# Altium schematic sheet dHandlebar_Lateral.SchDoc: dHandlebar_Lateral
size A4; Date: 05/09/2023; CheckedBy: Alejandro Veiga López; Author: Alejandro Veiga López; CompanyName: SICMA21; Engineer: Alejandro Veiga López; Organization: SICMA21; Address1: Carrer de la Ceràmica, 1; Address2: Montcada i Reixac, Barcelona; DocumentNumber: rfwe; Revision: rew; SheetNumber: 1; SheetTotal: 1; Project: PCB_dHandlebar_Lateral; Time: re; ProjectName: Smart Rollator
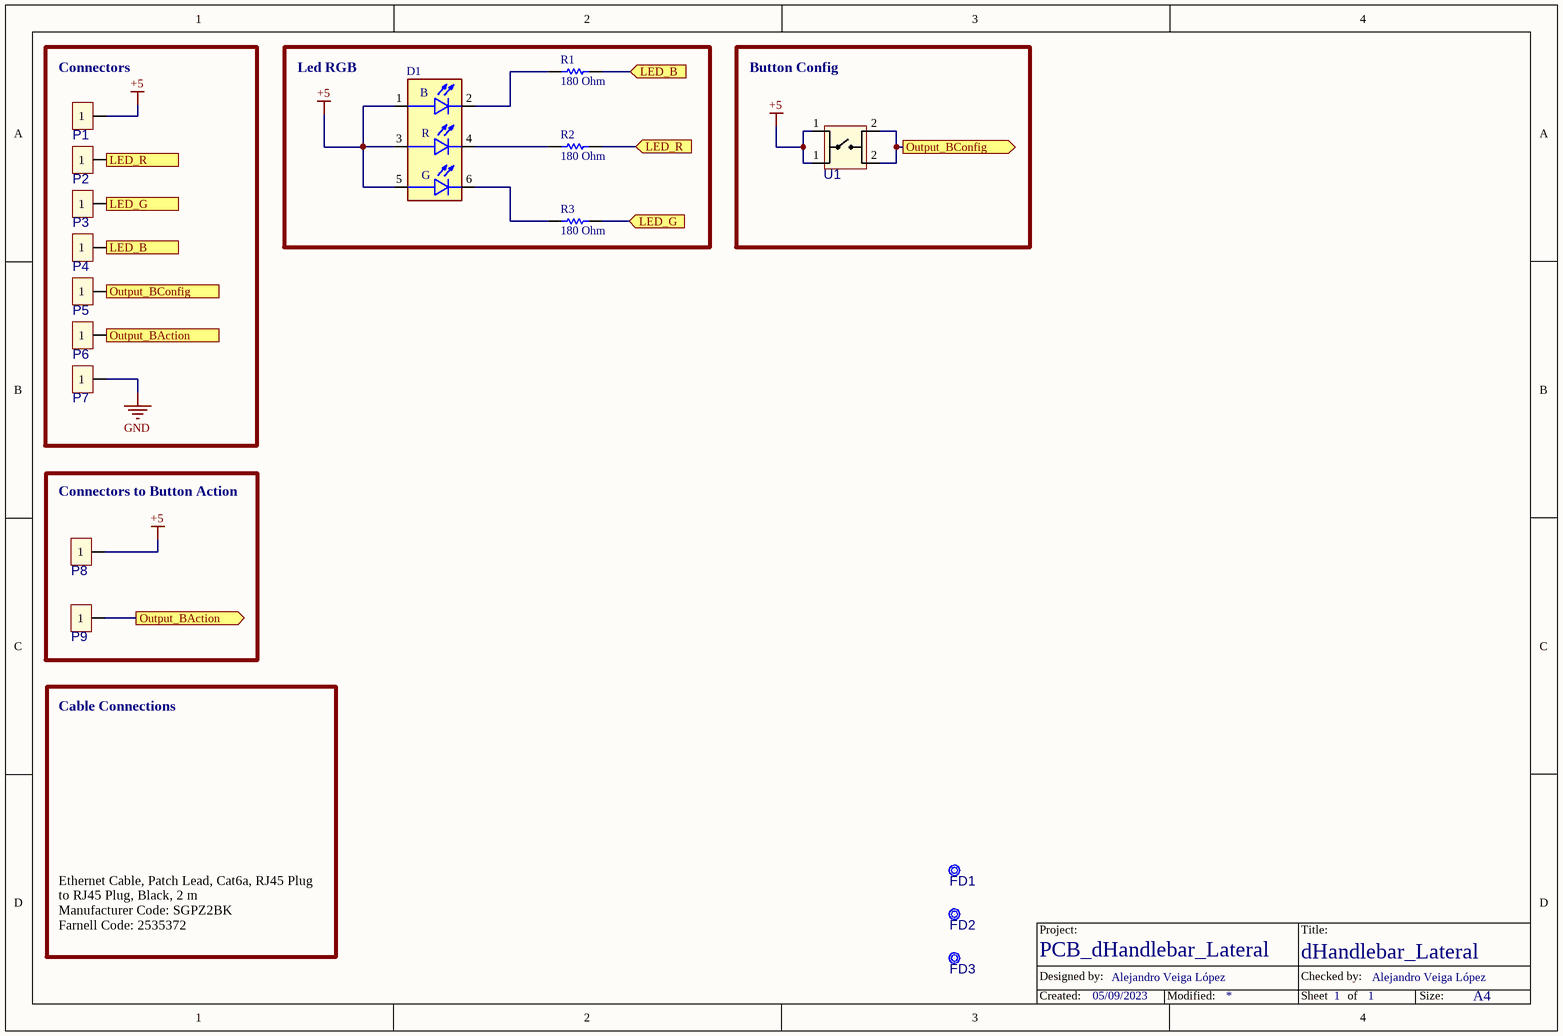
[diagram p0: dHandlebar_Lateral.SchDoc]

## Parts
D1  LED RGB  [LED RGB SMD - QLS6B-FKW-CNSNSF043]  (value not drawn)
FD1  FIDUCIAL ROUND  [Fiducial 1mm]  (value not drawn)
FD2  FIDUCIAL ROUND  [Fiducial 1mm]  (value not drawn)
FD3  FIDUCIAL ROUND  [Fiducial 1mm]  (value not drawn)
P1  JUMPER x2  [Connector - 1 Pad 1x2mm]  (value not drawn)
P2  JUMPER x2  [Connector - 1 Pad 1x2mm]  (value not drawn)
P3  JUMPER x2  [Connector - 1 Pad 1x2mm]  (value not drawn)
P4  JUMPER x2  [Connector - 1 Pad 1x2mm]  (value not drawn)
P5  JUMPER x2  [Connector - 1 Pad 1x2mm]  (value not drawn)
P6  JUMPER x2  [Connector - 1 Pad 1x2mm]  (value not drawn)
P7  JUMPER x2  [Connector - 1 Pad 1x2mm]  (value not drawn)
P8  JUMPER x2  [Connector - 1 Pad 1x2mm]  (value not drawn)
P9  JUMPER x2  [Connector - 1 Pad 1x2mm]  (value not drawn)
R1  value 180 Ohm  [RES 0805]  (hidden comment: Res 0805)
R2  value 180 Ohm  [RES 0805]  (hidden comment: Res 0805)
R3  value 180 Ohm  [RES 0805]  (hidden comment: Res 0805)
U1  Hall  [BUTTON - KSC541J]  (value not drawn)

## Blocks framed on the sheet
Connectors: P1-P7
Led RGB: D1 R1-R3
Button Config: U1
Connectors to Button Action: P8 P9

## Ports
LED_B (in), LED_B (out), LED_G (in), LED_G (out), LED_R (in), LED_R (out), Output_BAction (in), Output_BAction (out), Output_BConfig (in), Output_BConfig (out)

## Nets
+5: D1.1(BLUE_ANODE) D1.3(RED_ANODE) D1.5(GREEN_ANODE) P1.1 P8.1 U1.1(Vcc)
GND: P7.1
LED_B: P4.1 R1.1 ; port LED_B
LED_G: P3.1 R3.1 ; port LED_G
LED_R: P2.1 R2.1 ; port LED_R
Output_BAction: P6.1 P9.1 ; port Output_BAction
Output_BConfig: P5.1 U1.2(Vcc) ; port Output_BConfig
NetD1_2: D1.2(BLUE_CATHODE) R1.2
NetD1_4: D1.4(RED_CATHODE) R2.2
NetD1_6: D1.6(GREEN_CATHODE) R3.2

Not connected (* = marked no-connect by the designer): FD1 1; FD2 1; FD3 1

## Notes on the sheet
- Cable Connections
- Ethernet Cable, Patch Lead, Cat6a, RJ45 Plug to RJ45 Plug, Black, 2 m
  Manufacturer Code: SGPZ2BK
  Farnell Code: 2535372
- Designed by:
- Project:
- Title:
- Checked by:
- Created:
- Modified:
- Sheet
- of
- Size:
- A4
- (in symbol LED RGB QLS6B-FKW-CNSNSF043) B; R; G

## Library data of the parts
D1 = LED RGB QLS6B-FKW-CNSNSF043: LED, Superior, Transparente, RGB, Rojo, Verde, Azul, SMD, 120°, Redondo, R 30mA, V 30mA, B 30mA; LatestRevisionDate: 17-Jul-2002; LatestRevisionNote: Re-released for DXP Platform.; Publisher: Altium Limited; Supplier 1: Farnell; Supplier Part Number 1: 3217314; Supplier 2: Digi-Key; Supplier Part Number 2: QLS6B-FKW-CNSNSF043CT-ND; Supplier 3: Mouser; Supplier Part Number 3: 941-QLS6BFKWNSNSF043
FD1-FD3 = FIDUCIAL: MCHP-ID: MECH0282; Description_: FIDUCIAL ROUND PCB 1mm SMD; Dev Tools Status: Design; Owner: Dragos Danaila; Populated: MECH; Value: Fiducial; Revision: A; Symbol: FIDUCIAL ROUND; Status: MCL Design; ComponentLink1Description: SVN Datasheet; ComponentLink2Description: Local Datasheet; ComponentLink3URL: C:\ALTIUM_WORK\00001_MCHP-CDB\Library\LibraryRefs\FIDUCIAL ROUND.SchLib; ComponentLink3Description: Open Symbol; ComponentLink4URL: C:\ALTIUM_WORK\00001_MCHP-CDB\Library\Footprints\Fiducial_1mm.PcbLib; ComponentLink4Description: Open Footprint; ComponentLink5Description: Open Footprint 2; ComponentLink6Description: Open Footprint 3; ComponentLink7Description: Open Footprint 4; Type: Fiducial; Category: Hardware; Quantity Override: 1
P1-P9 = CONNECTOR PAD: Conector Pad; MCHP-ID: CON1108; Value: HDR-2.54 Male 1x2; Symbol: Header 1x2; Description_: CON HDR-2.54 Male 1x2 Gold 5.84MH TH VERT; Dev Tools Status: Production; Owner: Bogdan P (M91398); Populated: Yes; Revision: 1; Status: MCL Design; ComponentLink1URL: https://chn-vm-apps.microchip.com/mchprepo/parts/Datasheets/77311.pdf; ComponentLink1Description: SVN Datasheet; ComponentLink2URL: C:\ALTIUM_WORK\00001_MCHP-CDB\Datasheets\77311.pdf; ComponentLink2Description: Local Datasheet; ComponentLink3URL: C:\ALTIUM_WORK\00001_MCHP-CDB\Library\LibraryRefs\Header 1x2.SchLib; ComponentLink3Description: Open Symbol; ComponentLink4URL: C:\ALTIUM_WORK\00001_MCHP-CDB\Library\Footprints\HDR_M_2.54_1x2.PcbLib; ComponentLink4Description: Open Footprint; ComponentLink5Description: Open Footprint 2; ComponentLink6Description: Open Footprint 3; ComponentLink7Description: Open Footprint 4; Type: Header 2.54mm; Category: Connector; Quantity Override: 1
R1-R3 = R 0805: Resistencia SMD de Tipo Chip, Película Gruesa, 180 ohm, ± 1%, 500 mW, 0805 [Métrica 2012]; Published: 8-Jun-2000; LatestRevisionDate: 17-Jul-2002; LatestRevisionNote: Re-released for DXP Platform.; PackageReference: AXIAL-0.3; Publisher: Altium Limited; PackageDescription: Axial Device, Thru-Hole; 2 Leads; 0.3 in Pin Spacing; Supplier 1: Mouser; Supplier Part Number 1: 667-ERJ-P06F1800V; Supplier 2: Digi-Key; Supplier Part Number 2: P16063CT-ND; Supplier 3: Farnell; Supplier Part Number 3: 1750745
U1 = KSC541J: Interruptor Táctil, Sealed, KSC Series, Accionamiento Superior, Montaje Superficial, Botón Redondo; Revision: 1; ComponentLink5Description: Open Footprint 2; ComponentLink6Description: Open Footprint 3; ComponentLink7Description: Open Footprint 4; Supplier 1: Mouser; Supplier Part Number 1: 611-KSC541JROHS; Supplier 2: Digi-Key; Supplier Part Number 2: 401-1910-1-ND; Supplier 3: Farnell; Supplier Part Number 3: 3780578